# Altium project H750_CORE.PrjPcb
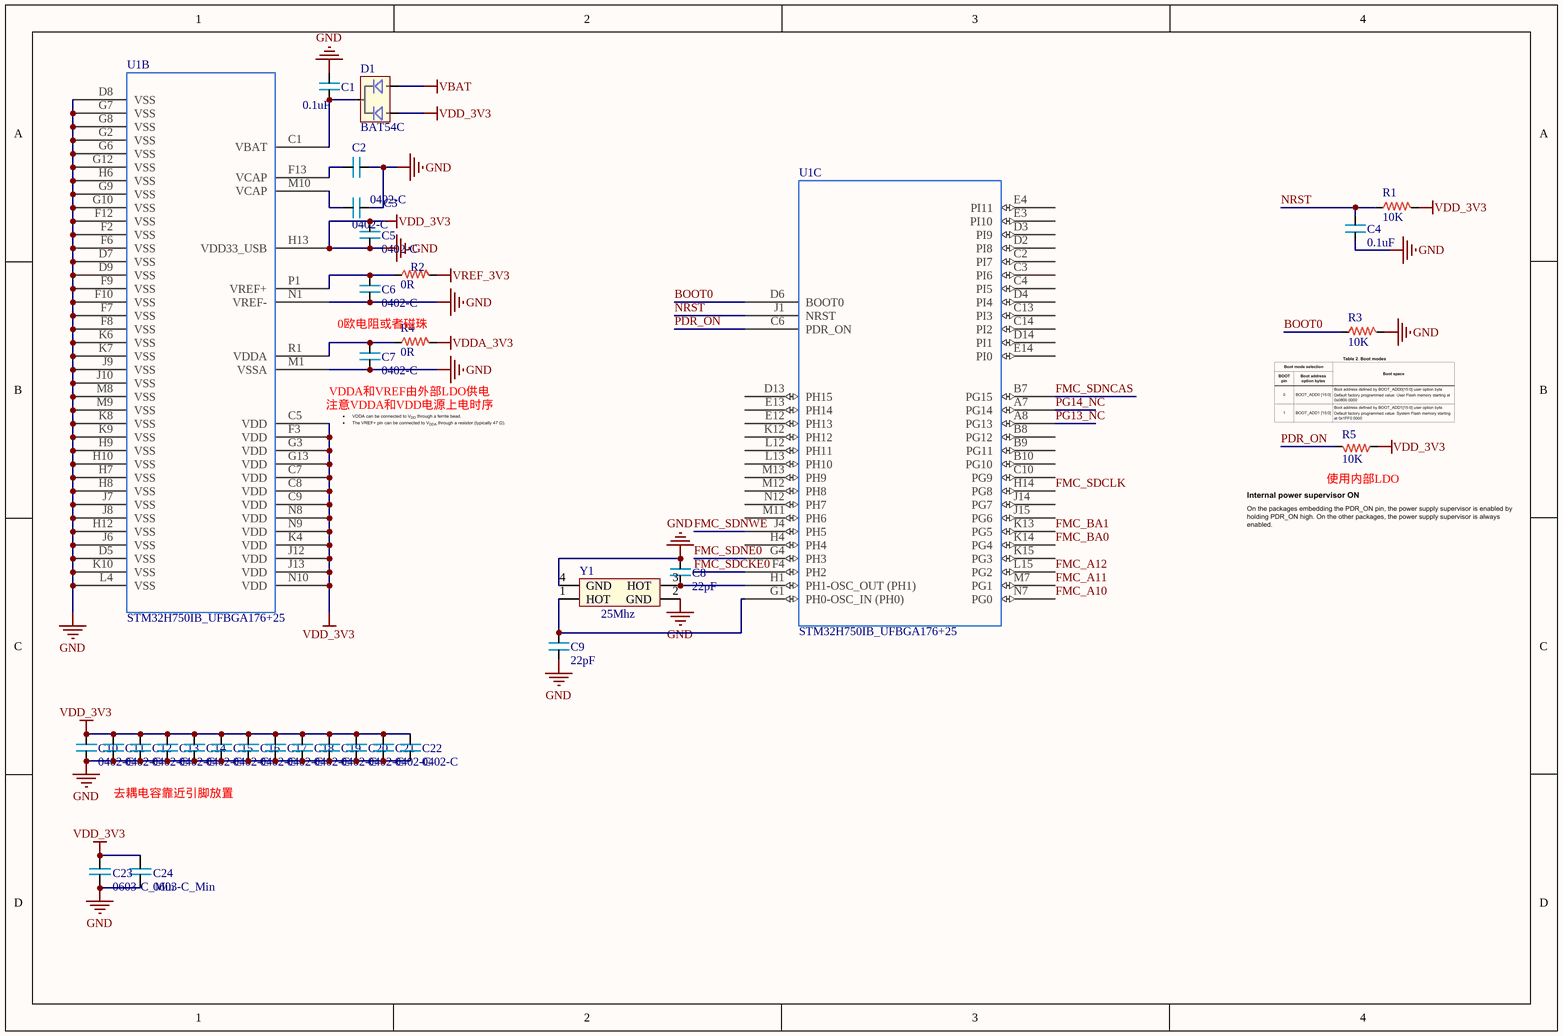
[diagram p0: STM32_H750_POWER.SchDoc]
3 sheets, 59 parts. Net scope: global (net labels, ports and power ports of the same name join across sheets).
Board file: CORE.PcbDoc
Sheets:
  STM32_H750_POWER.SchDoc
  STM32_H750_IO1.SchDoc
  STM32_H750_IO2.SchDoc

## Sheet STM32_H750_POWER.SchDoc
size A4; SheetNumber: 1; SheetTotal: 3

### Parts
C1  0.1uF  [0402]
C2  0402-C  [0402]
C3  0402-C  [0402]
C4  0.1uF  [0402]
C5  0402-C  [0402]
C6  0402-C  [0402]
C7  0402-C  [0402]
C8  22pF  [0402]
C9  22pF  [0402]
C10  0402-C  [0402]
C11  0402-C  [0402]
C12  0402-C  [0402]
C13  0402-C  [0402]
C14  0402-C  [0402]
C15  0402-C  [0402]
C16  0402-C  [0402]
C17  0402-C  [0402]
C18  0402-C  [0402]
C19  0402-C  [0402]
C20  0402-C  [0402]
C21  0402-C  [0402]
C22  0402-C  [0402]
C23  0603-C_Min  [0603P - 2]
C24  0603-C_Min  [0603P - 2]
D1  BAT54C  [SOT23-3]
R1  10K  [0402]
R2  0R  [0402]
R3  10K  [0402]
R4  0R  [0402]
R5  10K  [0402]
U1  STM32H750IB_UFBGA176+25  [STM32H750IB_UFBGA176+25]  (parts B,C of 3)
Y1  25Mhz  [XTAL3225]

### Nets
GND: C1.2 C2.1 C3.2 C4.1 C5.1 C5.2 C6.1 C7.1 C8.2 C9.2 C10.1 C10.2 C11.1 C11.2 C12.1 C12.2 C13.1 C13.2 C14.1 C14.2 C15.1 C15.2 C16.1 C16.2 C17.1 C17.2 C18.1 C18.2 C19.1 C19.2 C20.1 C20.2 C21.1 C21.2 C22.1 C22.2 C23.1 C23.2 C24.1 C24.2 D1.1 R1.2 R3.2 R5.1 U1.C5(VDD) U1.C7(VDD) U1.C8(VDD) U1.C9(VDD) U1.D5(VSS) U1.D7(VSS) U1.D8(VSS) U1.D9(VSS) U1.F2(VSS) U1.F3(VDD) U1.F6(VSS) U1.F7(VSS) U1.F8(VSS) U1.F9(VSS) U1.F10(VSS) U1.F12(VSS) U1.G2(VSS) U1.G3(VDD) U1.G6(VSS) U1.G7(VSS) U1.G8(VSS) U1.G9(VSS) U1.G10(VSS) U1.G12(VSS) U1.G13(VDD) U1.H6(VSS) U1.H7(VSS) U1.H8(VSS) U1.H9(VSS) U1.H10(VSS) U1.H12(VSS) U1.H13(VDD33_USB) U1.J6(VSS) U1.J7(VSS) U1.J8(VSS) U1.J9(VSS) U1.J10(VSS) U1.J12(VDD) U1.J13(VDD) U1.K4(VDD) U1.K6(VSS) U1.K7(VSS) U1.K8(VSS) U1.K9(VSS) U1.K10(VSS) U1.L4(VSS) U1.M1(VSSA) U1.M8(VSS) U1.M9(VSS) U1.N1(VREF-) U1.N8(VDD) U1.N9(VDD) U1.N10(VDD) Y1.2(GND) Y1.4(GND)  [also labelled VDD_3V3]
VBAT: D1.2
VDDA_3V3: R4.2
VREF_3V3: R2.2
BOOT0: R3.1 U1.D6(BOOT0)
FMC_A10: U1.N7(PG0)
FMC_A11: U1.M7(PG1)
FMC_A12: U1.L15(PG2)
FMC_BA0: U1.K14(PG4)
FMC_BA1: U1.K13(PG5)
FMC_SDCKE0: U1.F4(PH2)
FMC_SDCLK: U1.H14(PG8)
FMC_SDNCAS: U1.B7(PG15)
FMC_SDNE0: U1.G4(PH3)
FMC_SDNWE: U1.J4(PH5)
NRST: C4.2 R1.1 U1.J1(NRST)
PDR_ON: R5.2 U1.C6(PDR_ON)
PG13_NC: U1.A8(PG13)
PG14_NC: U1.A7(PG14)
NetC1_1: C1.1 D1.3 U1.C1(VBAT)
NetC2_2: C2.2 U1.F13(VCAP)
NetC3_1: C3.1 U1.M10(VCAP)
NetC6_2: C6.2 R2.1 U1.P1(VREF+)
NetC7_2: C7.2 R4.1 U1.R1(VDDA)
NetC8_1: C8.1 U1.H1(PH1-OSC_OUT_(PH1)) Y1.3(HOT)
NetC9_1: C9.1 U1.G1(PH0-OSC_IN_(PH0)) Y1.1(HOT)

Not connected (* = marked no-connect by the designer): U1 B8(PG12) B9(PG11) B10(PG10) C2(PI7) C3(PI6) C4(PI5) C10(PG9) C13(PI3) C14(PI2) D2(PI8) D3(PI9) D4(PI4) D13(PH15) D14(PI1) E3(PI10) E4(PI11) E12(PH13) E13(PH14) E14(PI0) H4(PH4) J14(PG7) J15(PG6) K12(PH12) K15(PG3) L12(PH11) L13(PH10) M11(PH6) M12(PH8) M13(PH9) N12(PH7)

### Notes on the sheet
- 0欧电阻或者磁珠
- (near C7) VDDA和VREF由外部LDO供电
- 注意VDDA和VDD电源上电时序
- (near R5) 使用内部LDO
- 去耦电容靠近引脚放置

### Library data of the parts
C1 C4 C8 C9 = 0402-C
D1 = BAT54C: 双肖特基二极管
R1-R5 = 0402-R
Y1 = XTAL_3225: 3225贴片无源晶振
U1 = STM32H750IB_UFBGA176+25: ComponentLink1Description: New link; ComponentLink1URL: *

## Sheet STM32_H750_IO1.SchDoc
size A4; SheetNumber: 2; SheetTotal: 3
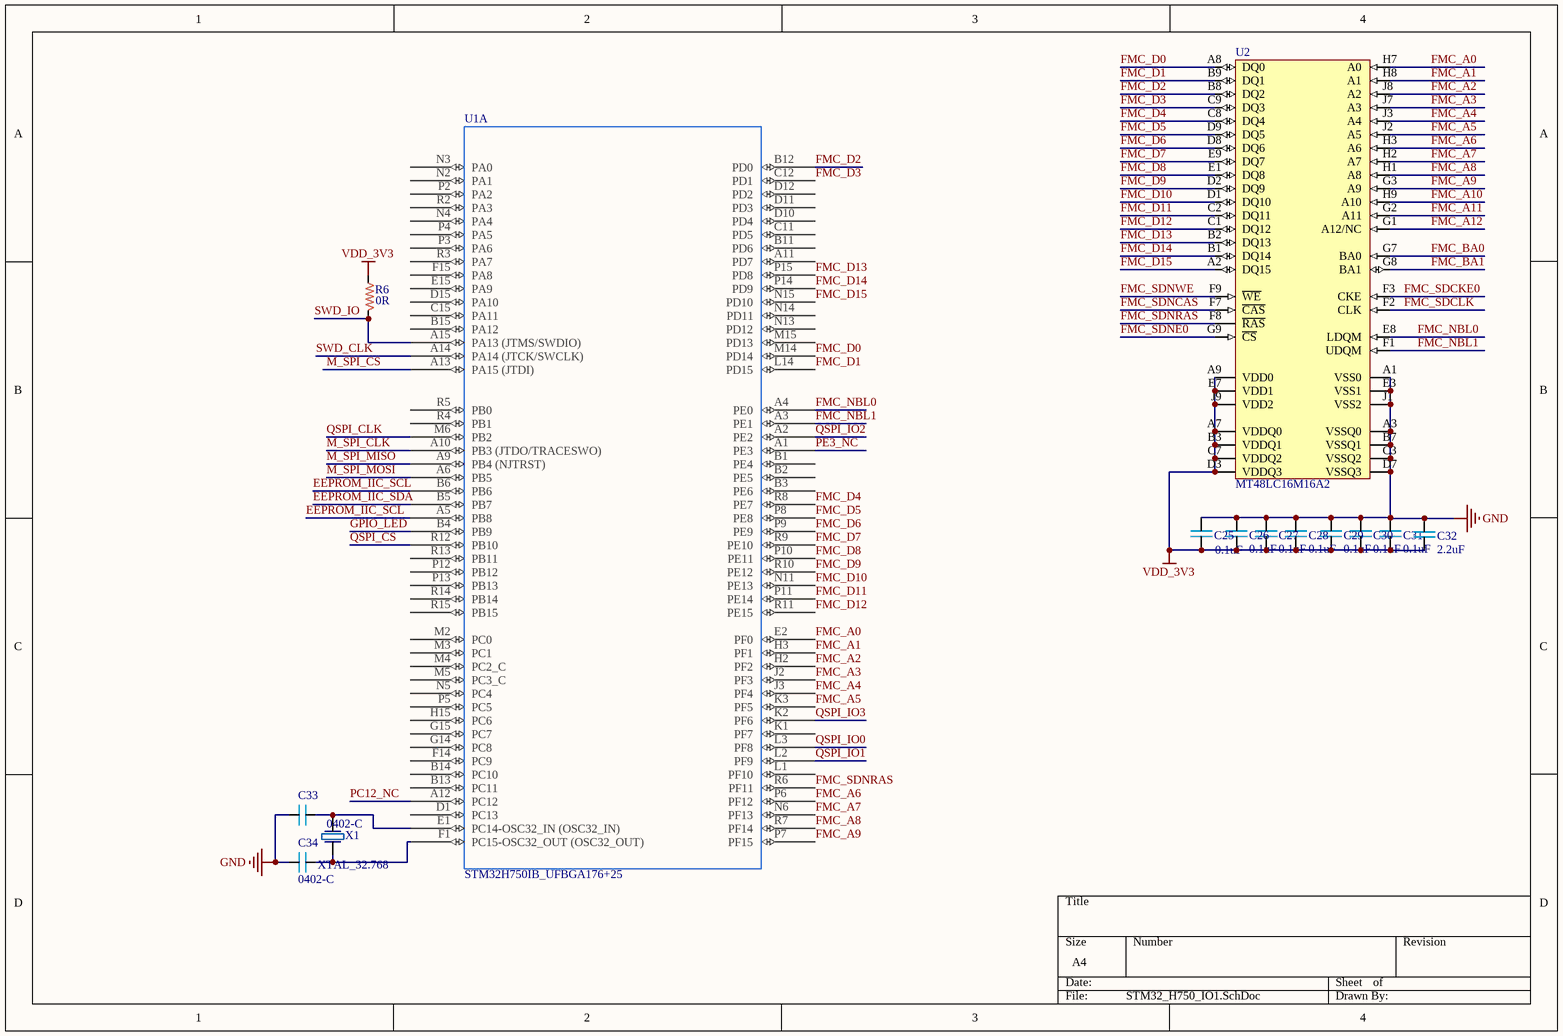
[diagram p1: STM32_H750_IO1.SchDoc]

### Parts
C25  0.1uF  [0402]
C26  0.1uF  [0402]
C27  0.1uF  [0402]
C28  0.1uF  [0402]
C29  0.1uF  [0402]
C30  0.1uF  [0402]
C31  0.1uF  [0402]
C32  2.2uF  [0603P - 2]
C33  0402-C  [0402]
C34  0402-C  [0402]
R6  0R  [0402]
U1  STM32H750IB_UFBGA176+25  [STM32H750IB_UFBGA176+25]  (part A of 3)
U2  MT48LC16M16A2  [BGA-54-L]
X1  XTAL_32.768  [XTAL3215]

### Nets
GND: C25.1 C25.2 C26.1 C26.2 C27.1 C27.2 C28.1 C28.2 C29.1 C29.2 C30.1 C30.2 C31.1 C31.2 C32.1 C32.2 C33.2 C34.2 R6.1 U2.A1(VSS0) U2.A3(VSSQ0) U2.A7(VDDQ0) U2.A9(VDD0) U2.B3(VDDQ1) U2.B7(VSSQ1) U2.C3(VSSQ2) U2.C7(VDDQ2) U2.D3(VDDQ3) U2.D7(VSSQ3) U2.E3(VSS1) U2.E7(VDD1) U2.J1(VSS2) U2.J9(VDD2)  [also labelled VDD_3V3]
EEPROM_IIC_SCL: U1.A5(PB8) U1.B6(PB6)
EEPROM_IIC_SDA: U1.B5(PB7)
FMC_A0: U1.E2(PF0) U2.H7(A0)
FMC_A1: U1.H3(PF1) U2.H8(A1)
FMC_A2: U1.H2(PF2) U2.J8(A2)
FMC_A3: U1.J2(PF3) U2.J7(A3)
FMC_A4: U1.J3(PF4) U2.J3(A4)
FMC_A5: U1.K3(PF5) U2.J2(A5)
FMC_A6: U1.P6(PF12) U2.H3(A6)
FMC_A7: U1.N6(PF13) U2.H2(A7)
FMC_A8: U1.R7(PF14) U2.H1(A8)
FMC_A9: U1.P7(PF15) U2.G3(A9)
FMC_A10: U2.H9(A10)
FMC_A11: U2.G2(A11)
FMC_A12: U2.G1(A12/NC)
FMC_BA0: U2.G7(BA0)
FMC_BA1: U2.G8(BA1)
FMC_D0: U1.M14(PD14) U2.A8(DQ0)
FMC_D1: U1.L14(PD15) U2.B9(DQ1)
FMC_D2: U1.B12(PD0) U2.B8(DQ2)
FMC_D3: U1.C12(PD1) U2.C9(DQ3)
FMC_D4: U1.R8(PE7) U2.C8(DQ4)
FMC_D5: U1.P8(PE8) U2.D9(DQ5)
FMC_D6: U1.P9(PE9) U2.D8(DQ6)
FMC_D7: U1.R9(PE10) U2.E9(DQ7)
FMC_D8: U1.P10(PE11) U2.E1(DQ8)
FMC_D9: U1.R10(PE12) U2.D2(DQ9)
FMC_D10: U1.N11(PE13) U2.D1(DQ10)
FMC_D11: U1.P11(PE14) U2.C2(DQ11)
FMC_D12: U1.R11(PE15) U2.C1(DQ12)
FMC_D13: U1.P15(PD8) U2.B2(DQ13)
FMC_D14: U1.P14(PD9) U2.B1(DQ14)
FMC_D15: U1.N15(PD10) U2.A2(DQ15)
FMC_NBL0: U1.A4(PE0) U2.E8(LDQM)
FMC_NBL1: U1.A3(PE1) U2.F1(UDQM)
FMC_SDCKE0: U2.F3(CKE)
FMC_SDCLK: U2.F2(CLK)
FMC_SDNCAS: U2.F7(~{CAS})
FMC_SDNE0: U2.G9(~{CS})
FMC_SDNRAS: U1.R6(PF11) U2.F8(~{RAS})
FMC_SDNWE: U2.F9(~{WE})
GPIO_LED: U1.B4(PB9)
M_SPI_CLK: U1.A10(PB3_(JTDO/TRACESWO))
M_SPI_CS: U1.A13(PA15_(JTDI))
M_SPI_MISO: U1.A9(PB4_(NJTRST))
M_SPI_MOSI: U1.A6(PB5)
PC12_NC: U1.A12(PC12)
PE3_NC: U1.A1(PE3)
QSPI_CLK: U1.M6(PB2)
QSPI_CS: U1.R12(PB10)
QSPI_IO0: U1.L3(PF8)
QSPI_IO1: U1.L2(PF9)
QSPI_IO2: U1.A2(PE2)
QSPI_IO3: U1.K2(PF6)
SWD_CLK: U1.A14(PA14_(JTCK/SWCLK))
SWD_IO: R6.2 U1.A15(PA13_(JTMS/SWDIO))
NetC33_1: C33.1 U1.E1(PC14-OSC32_IN_(OSC32_IN)) X1.1
NetC34_1: C34.1 U1.F1(PC15-OSC32_OUT_(OSC32_OUT)) X1.2

Not connected (* = marked no-connect by the designer): U1 A11(PD7) B1(PE4) B2(PE5) B3(PE6) B11(PD6) B13(PC11) B14(PC10) B15(PA12) C11(PD5) C15(PA11) D1(PC13) D10(PD4) D11(PD3) D12(PD2) D15(PA10) E15(PA9) F14(PC9) F15(PA8) G14(PC8) G15(PC7) H15(PC6) K1(PF7) L1(PF10) M2(PC0) M3(PC1) M4(PC2_C) M5(PC3_C) M15(PD13) N2(PA1) N3(PA0) N4(PA4) N5(PC4) N13(PD12) N14(PD11) P2(PA2) P3(PA6) P4(PA5) P5(PC5) P12(PB12) P13(PB13) R2(PA3) R3(PA7) R4(PB1) R5(PB0) R13(PB11) R14(PB14) R15(PB15)

### Library data of the parts
C25-C31 = 0402-C
C32 = 0603-C_Min
R6 = 0402-R
U2 = MT48LC16M16A2: 32MB SDRAM
X1 = XTAL_32.768: 32.768晶振
U1 = STM32H750IB_UFBGA176+25: ComponentLink1Description: New link; ComponentLink1URL: *

## Sheet STM32_H750_IO2.SchDoc
size A4; SheetNumber: 3; SheetTotal: 3
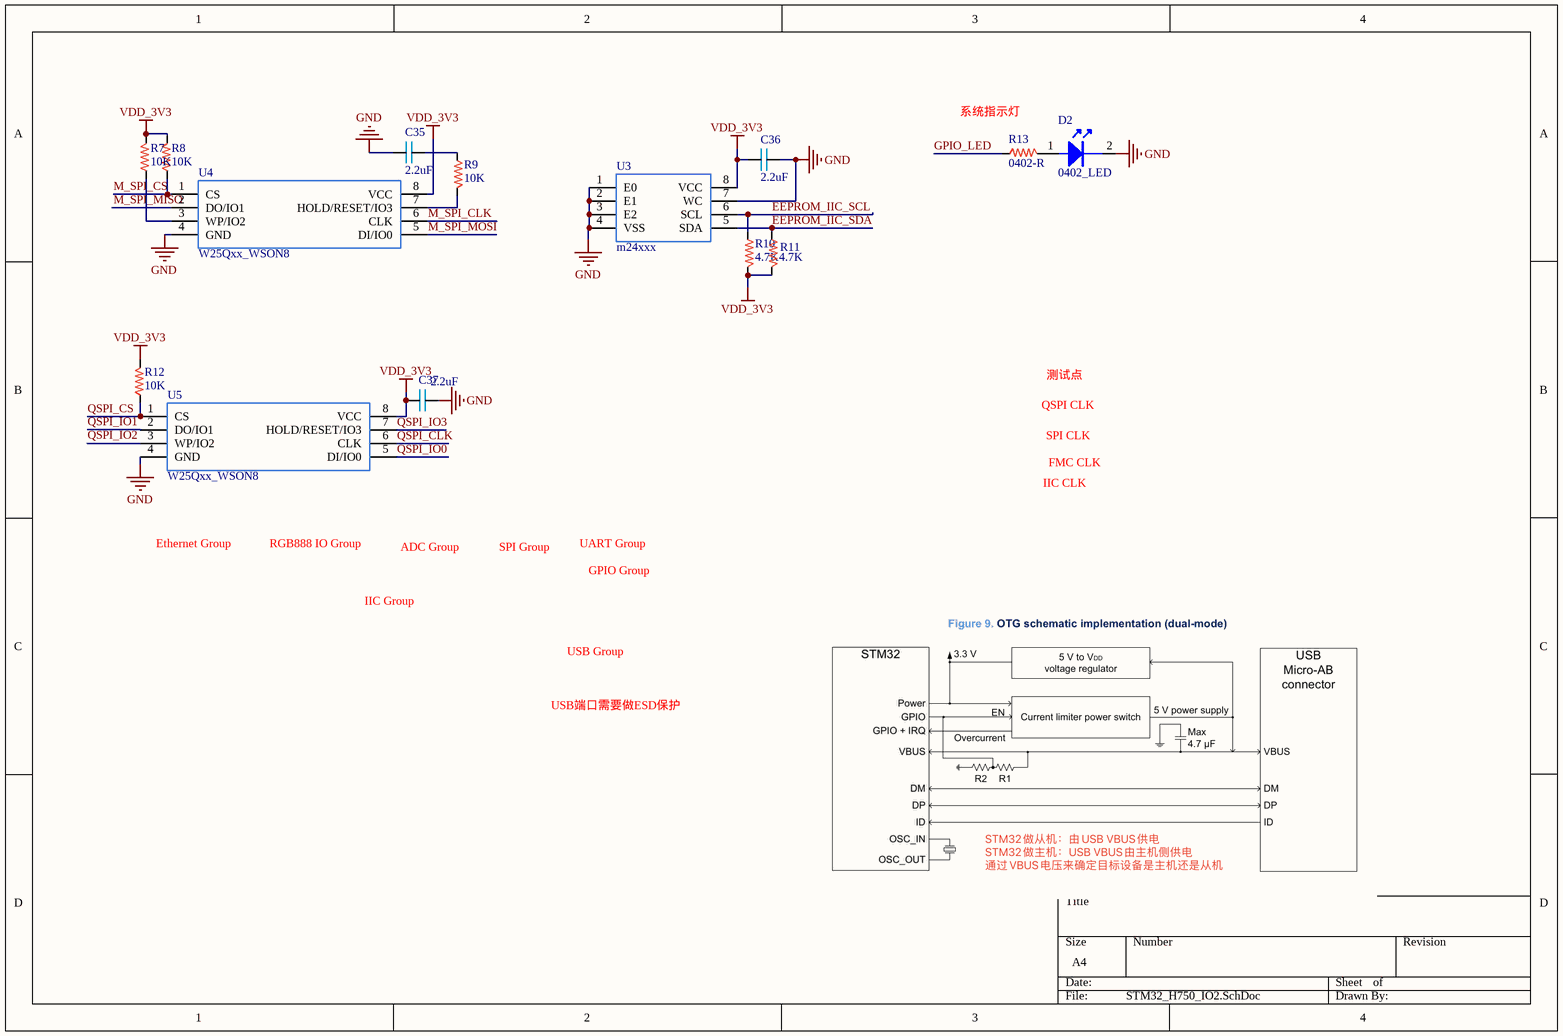
[diagram p2: STM32_H750_IO2.SchDoc]

### Parts
C35  2.2uF  [0603P - 2]
C36  2.2uF  [0603P - 2]
C37  2.2uF  [0603P - 2]
D2  0402_LED  [0402 - LED]
R7  10K  [0402]
R8  10K  [0402]
R9  10K  [0402]
R10  4.7K  [0402]
R11  4.7K  [0402]
R12  10K  [0402]
R13  0402-R  [0402]
U3  m24xxx  [DFN-8]
U4  W25Qxx_WSON8  [WSON-8]
U5  W25Qxx_WSON8  [WSON-8]

### Nets
GND: C35.2 C36.1 C36.2 C37.1 C37.2 D2.2 R7.2 R8.2 R10.2 R11.2 R12.2 U3.1(E0) U3.2(E1) U3.3(E2) U3.4(VSS) U3.7(WC) U3.8(VCC) U4.4(GND) U4.8(VCC) U5.4(GND) U5.8(VCC)  [also labelled VDD_3V3]
EEPROM_IIC_SCL: R10.1 U3.6(SCL)
EEPROM_IIC_SDA: R11.1 U3.5(SDA)
GPIO_LED: R13.1
M_SPI_CLK: U4.6(CLK)
M_SPI_CS: R8.1 U4.1(CS)
M_SPI_MISO: U4.2(DO/IO1)
M_SPI_MOSI: U4.5(DI/IO0)
QSPI_CLK: U5.6(CLK)
QSPI_CS: R12.1 U5.1(CS)
QSPI_IO0: U5.5(DI/IO0)
QSPI_IO1: U5.2(DO/IO1)
QSPI_IO2: U5.3(WP/IO2)
QSPI_IO3: U5.7(HOLD/RESET/IO3)
NetC35_1: C35.1 R9.1
NetD2_1: D2.1 R13.2
NetR7_1: R7.1 U4.3(WP/IO2)
NetR9_2: R9.2 U4.7(HOLD/RESET/IO3)

### Notes on the sheet
- (near R13) 系统指示灯
- 测试点
- QSPI CLK
- SPI CLK
- FMC CLK
- IIC CLK
- Ethernet Group
- RGB888 IO Group
- ADC Group
- SPI Group
- UART Group
- GPIO Group
- IIC Group
- USB Group
- USB端口需要做ESD保护

### Library data of the parts
C35-C37 = 0603-C_Min
R7-R12 = 0402-R
U3 = m24xxx: ST EEPROM

## Nets that join several sheets
GND: STM32_H750_POWER (99 pins), STM32_H750_IO1 (33 pins), STM32_H750_IO2 (21 pins)
EEPROM_IIC_SCL: STM32_H750_IO1 (U1.A5 U1.B6), STM32_H750_IO2 (R10.1 U3.6)
EEPROM_IIC_SDA: STM32_H750_IO1 (U1.B5), STM32_H750_IO2 (R11.1 U3.5)
FMC_A10: STM32_H750_POWER (U1.N7), STM32_H750_IO1 (U2.H9)
FMC_A11: STM32_H750_POWER (U1.M7), STM32_H750_IO1 (U2.G2)
FMC_A12: STM32_H750_POWER (U1.L15), STM32_H750_IO1 (U2.G1)
FMC_BA0: STM32_H750_POWER (U1.K14), STM32_H750_IO1 (U2.G7)
FMC_BA1: STM32_H750_POWER (U1.K13), STM32_H750_IO1 (U2.G8)
FMC_SDCKE0: STM32_H750_POWER (U1.F4), STM32_H750_IO1 (U2.F3)
FMC_SDCLK: STM32_H750_POWER (U1.H14), STM32_H750_IO1 (U2.F2)
FMC_SDNCAS: STM32_H750_POWER (U1.B7), STM32_H750_IO1 (U2.F7)
FMC_SDNE0: STM32_H750_POWER (U1.G4), STM32_H750_IO1 (U2.G9)
FMC_SDNWE: STM32_H750_POWER (U1.J4), STM32_H750_IO1 (U2.F9)
GPIO_LED: STM32_H750_IO1 (U1.B4), STM32_H750_IO2 (R13.1)
M_SPI_CLK: STM32_H750_IO1 (U1.A10), STM32_H750_IO2 (U4.6)
M_SPI_CS: STM32_H750_IO1 (U1.A13), STM32_H750_IO2 (R8.1 U4.1)
M_SPI_MISO: STM32_H750_IO1 (U1.A9), STM32_H750_IO2 (U4.2)
M_SPI_MOSI: STM32_H750_IO1 (U1.A6), STM32_H750_IO2 (U4.5)
QSPI_CLK: STM32_H750_IO1 (U1.M6), STM32_H750_IO2 (U5.6)
QSPI_CS: STM32_H750_IO1 (U1.R12), STM32_H750_IO2 (R12.1 U5.1)
QSPI_IO0: STM32_H750_IO1 (U1.L3), STM32_H750_IO2 (U5.5)
QSPI_IO1: STM32_H750_IO1 (U1.L2), STM32_H750_IO2 (U5.2)
QSPI_IO2: STM32_H750_IO1 (U1.A2), STM32_H750_IO2 (U5.3)
QSPI_IO3: STM32_H750_IO1 (U1.K2), STM32_H750_IO2 (U5.7)